# EAGLE schematic parametric_eq (EAGLE 7.1.0)
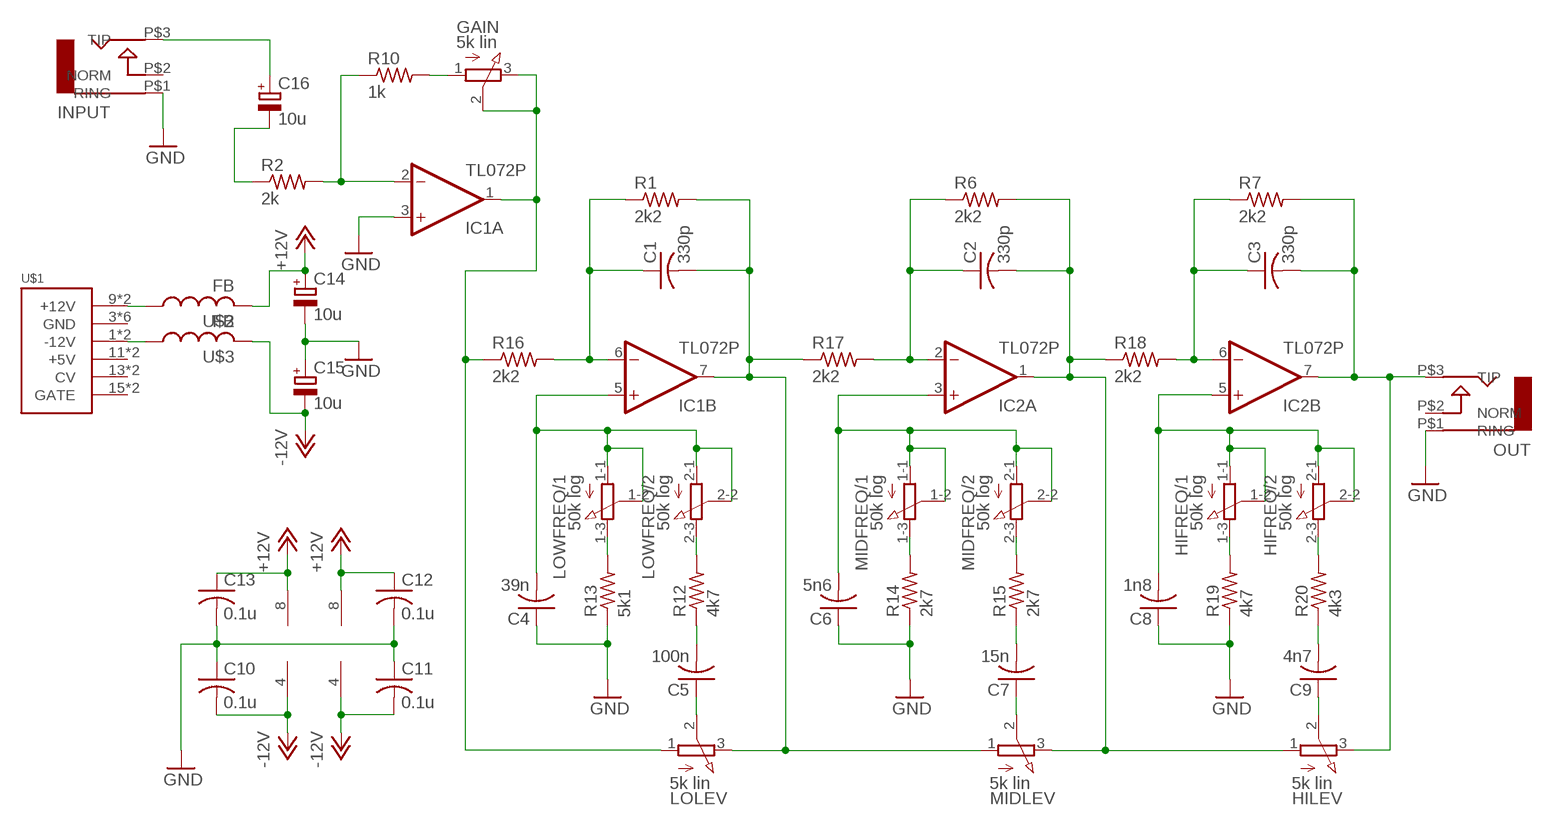
[diagram p0: schematic, sheet 1]

## Parts
C1  330p  C-US050-050X075  [C050-050X075]
C2  330p  C-US050-050X075  [C050-050X075]
C3  330p  C-US050-050X075  [C050-050X075]
C4  39n  C-US050-050X075  [C050-050X075]
C5  100n  C-US050-050X075  [C050-050X075]
C6  5n6  C-US050-050X075  [C050-050X075]
C7  15n  C-US075-032X103  [C075-032X103]
C8  1n8  C-US050-050X075  [C050-050X075]
C9  4n7  C-US050-050X075  [C050-050X075]
C10  0.1u  C-US025-030X050  [C025-030X050]
C11  0.1u  C-US025-030X050  [C025-030X050]
C12  0.1u  C-US025-030X050  [C025-030X050]
C13  0.1u  C-US025-030X050  [C025-030X050]
C14  10u  CPOL-EUB45181A  [B45181A]
C15  10u  CPOL-EUB45181A  [B45181A]
C16  10u  CPOL-EUB45181A  [B45181A]
GAIN  5k lin  PTD901  [PTD901]
HIFREQ  50k log  PTD902PTD902  [PTD902]
HILEV  5k lin  PTD901  [PTD901]
IC1  TL072P  [DIL08]
IC2  TL072P  [DIL08]
INPUT  AUDIO-JACK  [ERTHENVAR-JACK-90DEG]
LOLEV  5k lin  PTD901  [PTD901]
LOWFREQ  50k log  PTD902PTD902  [PTD902]
MIDFREQ  50k log  PTD902PTD902  [PTD902]
MIDLEV  5k lin  PTD901  [PTD901]
OUT  AUDIO-JACK  [ERTHENVAR-JACK-90DEG]
R1  2k2  R-US_0207/10  [0207/10]
R2  2k  R-US_0207/10  [0207/10]
R6  2k2  R-US_0207/10  [0207/10]
R7  2k2  R-US_0207/10  [0207/10]
R10  1k  R-US_0207/10  [0207/10]
R12  4k7  R-US_0207/10  [0207/10]
R13  5k1  R-US_0207/10  [0207/10]
R14  2k7  R-US_0207/10  [0207/10]
R15  2k7  R-US_0207/10  [0207/10]
R16  2k2  R-US_0207/10  [0207/10]
R17  2k2  R-US_0207/10  [0207/10]
R18  2k2  R-US_0207/10  [0207/10]
R19  4k7  R-US_0207/10  [0207/10]
R20  4k3  R-US_0207/10  [0207/10]
U$1  POWER  [POWER_16]
U$2  FB  [FB]
U$3  FB  [FB]

## Nets
+12V: C12.1 C13.1 C14.+ IC1.8(P:V+) IC2.8(P:V+) U$2.P$2
-12V: C10.2 C11.2 C15.- IC1.4(P:V-) IC2.4(P:V-) U$3.P$2
GND: C4.1 C6.1 C8.1 C10.1 C11.1 C12.2 C13.2 C14.- C15.+ IC1.3(A:+IN) INPUT.P$1(RING) OUT.P$1(RING) R13.1 R14.1 R19.1
N$1: IC1.2(A:-IN) R2.2 R10.1
N$2: GAIN.1(A) R10.2
N$3: C2.1 IC2.2(A:-IN) R6.1 R17.2
N$4: C3.1 IC2.6(B:-IN) R7.1 R18.2
N$5: C1.1 IC1.6(B:-IN) R1.1 R16.2
N$6: C1.2 IC1.7(B:OUT) LOLEV.3(E) MIDLEV.1(A) R1.2 R17.1
N$7: C2.2 HILEV.1(A) IC2.1(A:OUT) MIDLEV.3(E) R6.2 R18.1
N$8: C3.2 HILEV.3(E) IC2.7(B:OUT) OUT.P$3(TIP) R7.2
N$9: C16.+ INPUT.P$3(TIP)
N$10: LOWFREQ.1-3(/1:E) R13.2
N$11: C5.2 R12.1
N$12: LOWFREQ.2-3(/2:E) R12.2
N$13: C5.1 LOLEV.2(S)
N$14: C7.1 MIDLEV.2(S)
N$15: C7.2 R15.1
N$16: MIDFREQ.2-3(/2:E) R15.2
N$17: MIDFREQ.1-3(/1:E) R14.2
N$18: HIFREQ.1-3(/1:E) R19.2
N$19: HIFREQ.2-3(/2:E) R20.2
N$20: C9.2 R20.1
N$21: C9.1 HILEV.2(S)
N$22: C4.2 IC1.5(B:+IN) LOWFREQ.1-1(/1:A) LOWFREQ.1-2(/1:S) LOWFREQ.2-1(/2:A) LOWFREQ.2-2(/2:S)
N$23: GAIN.2(S) GAIN.3(E) IC1.1(A:OUT) LOLEV.1(A) R16.1
N$24: C16.- R2.1
N$25: U$1.9(+12V) U$1.10(+12V) U$2.P$1
N$26: U$1.1(-12V) U$1.2(-12V) U$3.P$1
N$27: C6.2 IC2.3(A:+IN) MIDFREQ.1-1(/1:A) MIDFREQ.1-2(/1:S) MIDFREQ.2-1(/2:A) MIDFREQ.2-2(/2:S)
N$28: C8.2 HIFREQ.1-1(/1:A) HIFREQ.1-2(/1:S) HIFREQ.2-1(/2:A) HIFREQ.2-2(/2:S) IC2.5(B:+IN)
Unconnected: INPUT.P$2(NORM) OUT.P$2(NORM) U$1.3(GND) U$1.4(GND) U$1.5(GND) U$1.6(GND) U$1.7(GND) U$1.8(GND) U$1.11(+5V) U$1.12(+5V) U$1.13(CV) U$1.14(CV) U$1.15(GATE) U$1.16(GATE)

## Library data of the parts
C1-C13 = rcl:C-US: CAPACITOR, American symbol
C14-C16 = rcl:CPOL-EU: POLARIZED CAPACITOR, European symbol
GAIN HILEV LOLEV MIDLEV = bourns_ptd:PTD901: 16mm Potentiometer one level Source: http://www.alphapotentiometers.net/html/16mm_pot_2.html
HIFREQ LOWFREQ MIDFREQ = bourns_ptd:PTD902: Bourns PTD Potentiometer two-level Source: http://www.mouser.com/ds/2/54/ptd90-35260.pdf
IC1 IC2 = linear:TL072: OP AMP
INPUT OUT = erthenvar:AUDIO-JACK: Switching Mono 3.5mm Audio Jack from Erthenvar.
R1 R2 R6 R7 R10 R12-R20 = rcl:R-US_: RESISTOR, American symbol
U$1 = eurorack:POWER
U$2 U$3 = adafruit:FB: Ferrite bead Digikey #P9821BK-ND